# Altium project XXXX.467119.XXX.PrjPcb
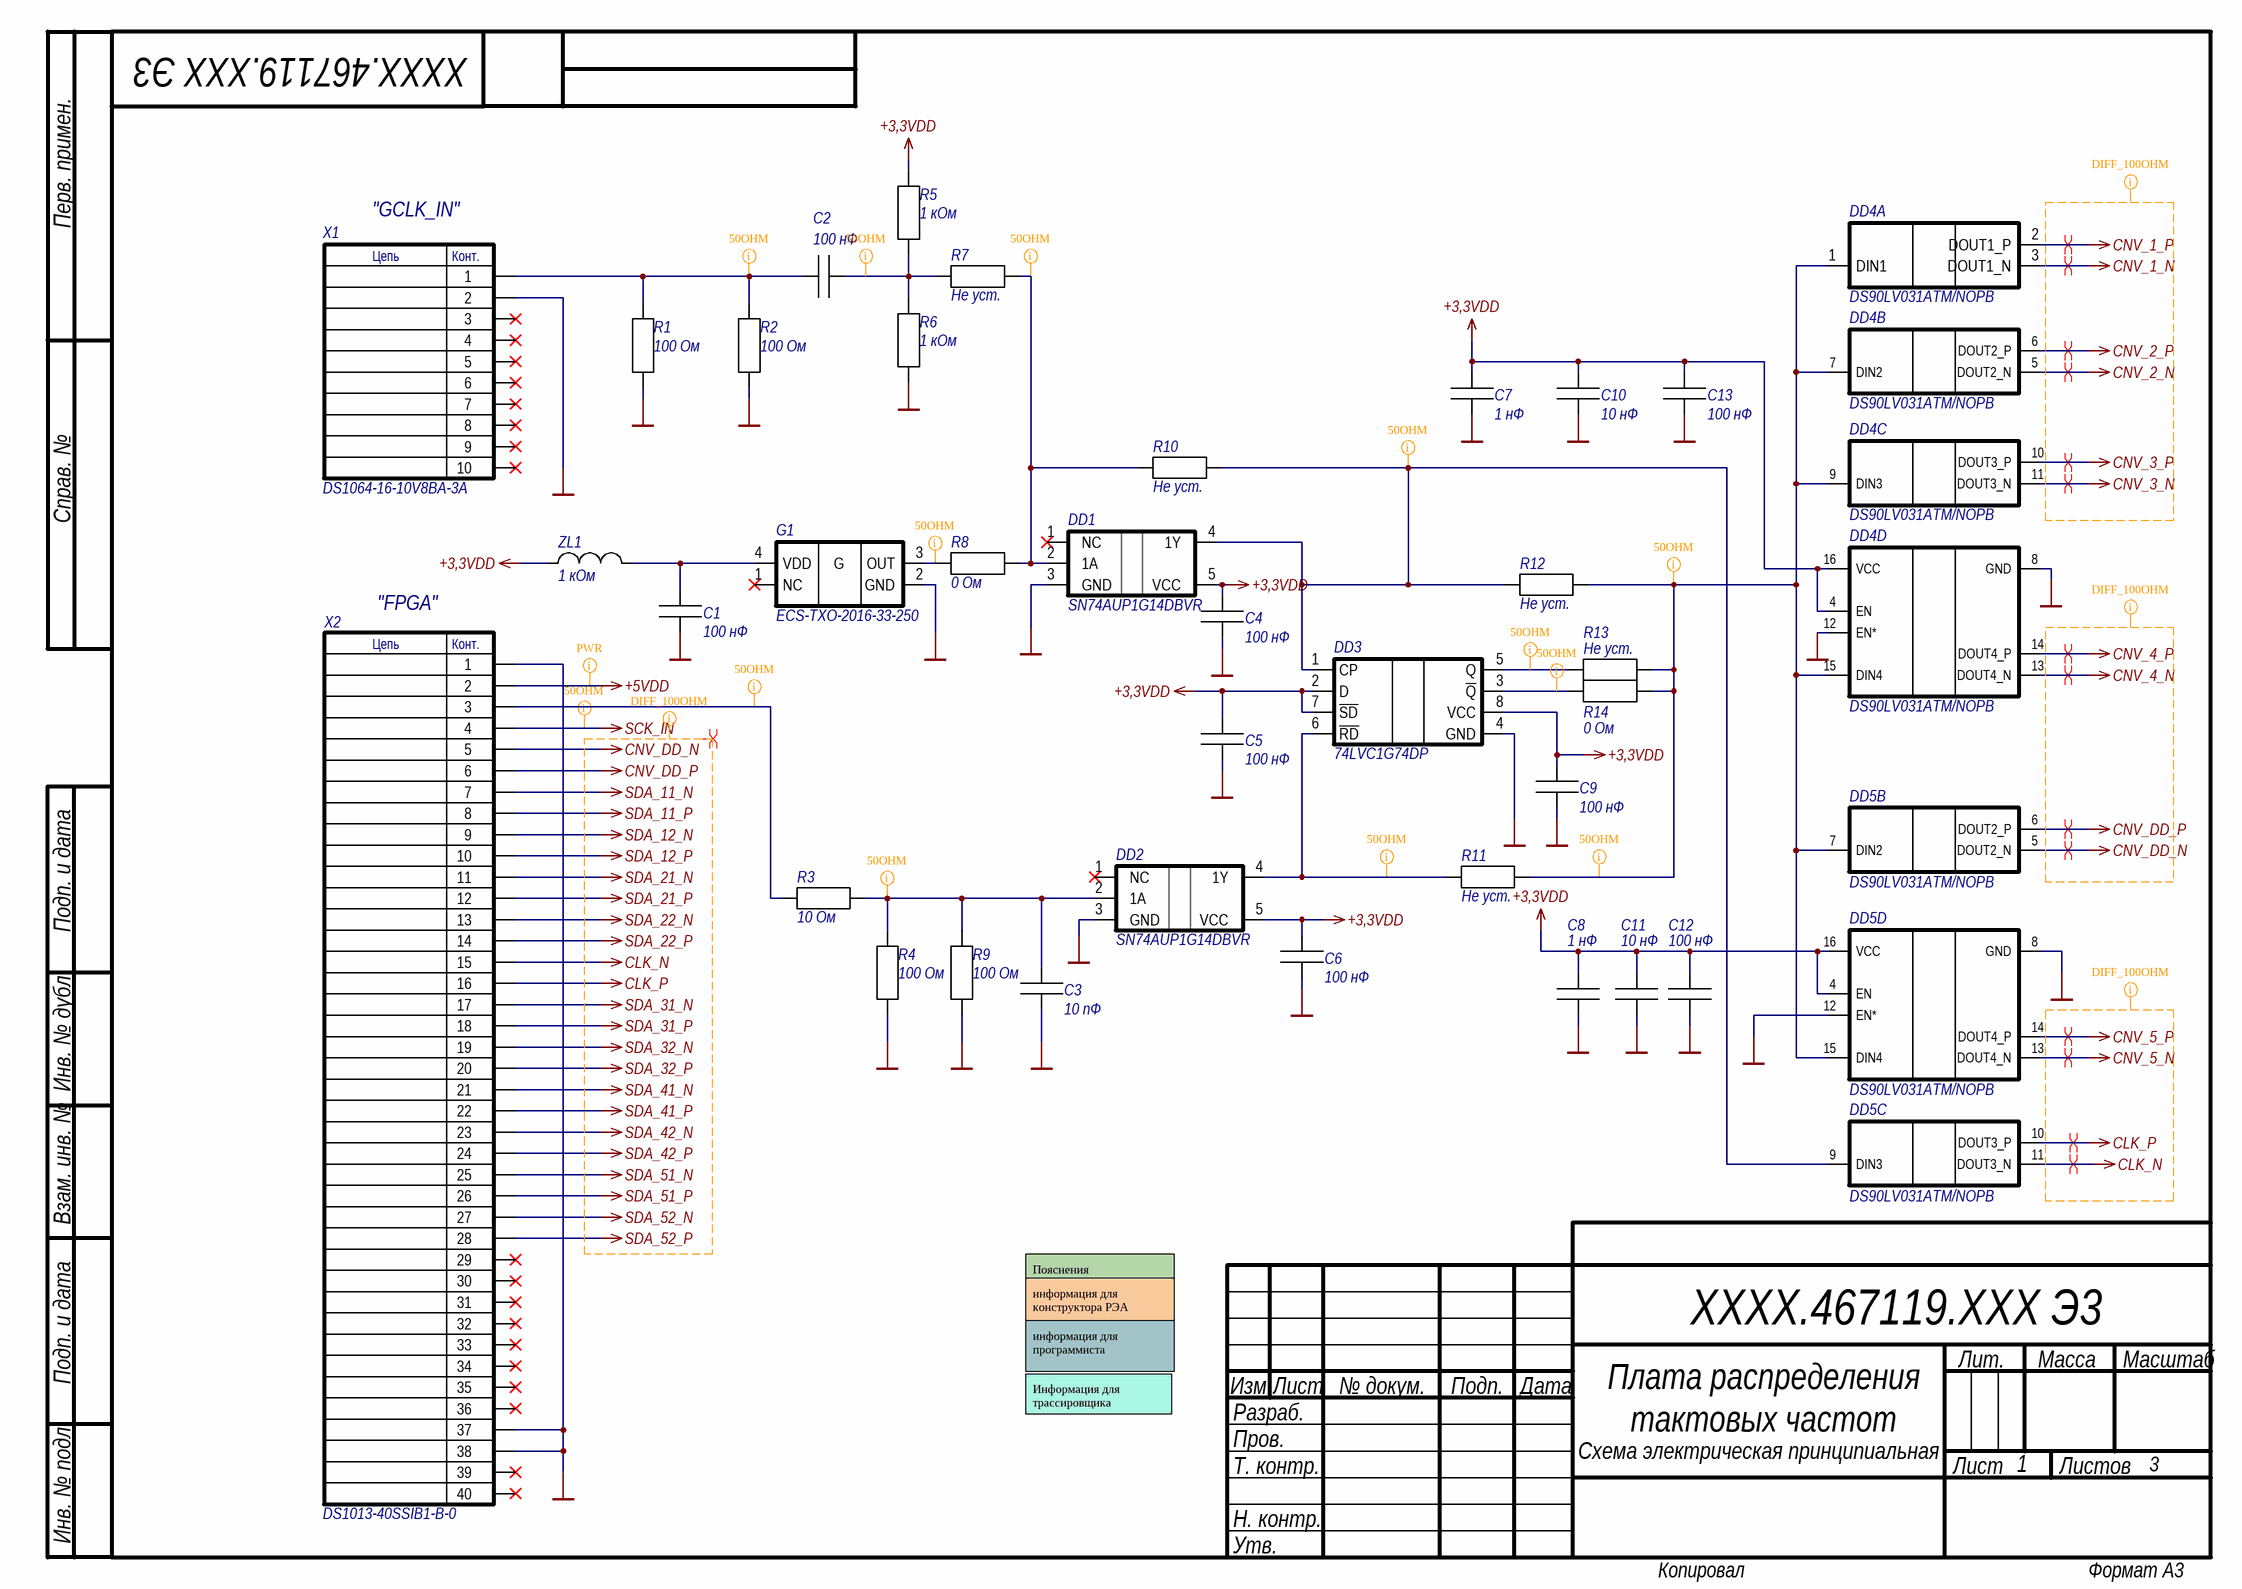
[diagram p0: xxxxxx.001_sh1_RTC.SchDoc]
3 sheets, 65 parts. Net scope: global (net labels, ports and power ports of the same name join across sheets).
Board file: XXXX.687252.XXX.PcbDoc
Sheets:
  xxxxxx.001_sh1_RTC.SchDoc
  xxxxxx.001_sh2_RTC.SchDoc
  xxxxxx.001_sh3_RTC.SchDoc

## Sheet xxxxxx.001_sh1_RTC.SchDoc
size 419 x 297 mm; DocumentNumber: XXXX.467119.XXX Э3; SheetNumber: 1; SheetTotal: 3; Title1str: Плата распределения; Title2str: тактовых частот; PageSetup: Record=PageOptions|CenterHorizontal=False|CenterVertical=False|PrintScale=1.00|XCorrection=0.00|YCorrection=0.00|PrintKind=1|BorderSize=5000000|LeftOffset=0|BottomOffset=0|Orientation=2|PaperLength=1000|PaperWidth=1000|Scale=100|PaperSource=7|PrintQuality=-4|MediaType=1|DitherType=10|PrintScaleMode=0|PaperKind=A3|PaperIndex=8; TypeOfSchem: Схема электрическая принципиальная; DocumentNumberE3: XXXX.467119.XXX Э3; DocumentName: Sheet1.SCHDOC

### Parts
C1  100 нФ  [CAPC160X080X080N]
C2  100 нФ  [CAPC160X080X080N]
C3  10 пФ  [CAPC160X080X080N]
C4  100 нФ  [CAPC160X080X080N]
C5  100 нФ  [CAPC160X080X080N]
C6  100 нФ  [CAPC160X080X080N]
C7  1 нФ  [CAPC160X080X080N]
C8  1 нФ  [CAPC160X080X080N]
C9  100 нФ  [CAPC160X080X080N]
C10  10 нФ  [CAPC160X080X080N]
C11  10 нФ  [CAPC160X080X080N]
C12  100 нФ  [CAPC160X080X080N]
C13  100 нФ  [CAPC160X080X080N]
DD1  SN74AUP1G14DBVR  [TI_DBV0005A_SOT23_5]
DD2  SN74AUP1G14DBVR  [TI_DBV0005A_SOT23_5]
DD3  74LVC1G74DP  [TSOP65P400X110-8N]
DD4  DS90LV031ATM/NOPB  [SOIC127P600X175-16N]  (parts A,B,C,D of 4)
DD5  DS90LV031ATM/NOPB  [SOIC127P600X175-16N]  (parts B,C,D of 4)
G1  ECS-TXO-2016-33-250  [OSCCC160X200X80-4N]
R1  100 Ом  [RESC160X080X045N]
R2  100 Ом  [RESC160X080X045N]
R3  10 Ом  [RESC160X080X045N]
R4  100 Ом  [RESC160X080X045N]
R5  1 кОм  [RESC160X080X045N]
R6  1 кОм  [RESC160X080X045N]
R7  Не уст.  [RESC160X080X045N]
R8  0 Ом  [RESC160X080X045N]
R9  100 Ом  [RESC160X080X045N]
R10  Не уст.  [RESC160X080X045N]
R11  Не уст.  [RESC160X080X045N]
R12  Не уст.  [RESC160X080X045N]
R13  Не уст.  [RESC160X080X045N]
R14  0 Ом  [RESC160X080X045N]
X1  DS1064-16-10V8BA-3A  [BHTH127x254_2X5]
X2  DS1013-40SSIB1-B-0  [BHTH254_2X20]
ZL1  1 кОм  [INDC100X050X050N]

### Nets
+3,3VDD: C4.1 C5.1 C6.1 C7.1 C8.1 C9.1 C10.1 C11.1 C12.1 C13.1 DD1.5(VCC) DD2.5(VCC) DD3.2(D) DD3.7(~{SD}) DD3.8(VCC) DD4.4(EN) DD4.16(VCC) DD5.4(EN) DD5.16(VCC) R5.1 ZL1.1
+5VDD: X2.2
CLK_N: DD5.11(DOUT3_N) X2.15
CLK_P: DD5.10(DOUT3_P) X2.16
CNV_1_N: DD4.3(DOUT1_N)
CNV_1_P: DD4.2(DOUT1_P)
CNV_2_N: DD4.5(DOUT2_N)
CNV_2_P: DD4.6(DOUT2_P)
CNV_3_N: DD4.11(DOUT3_N)
CNV_3_P: DD4.10(DOUT3_P)
CNV_4_N: DD4.13(DOUT4_N)
CNV_4_P: DD4.14(DOUT4_P)
CNV_5_N: DD5.13(DOUT4_N)
CNV_5_P: DD5.14(DOUT4_P)
CNV_DD_N: DD5.5(DOUT2_N) X2.5
CNV_DD_P: DD5.6(DOUT2_P) X2.6
GND: C1.2 C3.2 C4.2 C5.2 C6.2 C7.2 C8.2 C9.2 C10.2 C11.2 C12.2 C13.2 DD1.3(GND) DD2.3(GND) DD3.4(GND) DD4.8(GND) DD4.12(EN*) DD5.8(GND) DD5.12(EN*) G1.2(GND) R1.2 R2.2 R4.2 R6.2 R9.2 X1.2 X2.1 X2.37 X2.38
SCK_IN: X2.4
SDA_11_N: X2.7
SDA_11_P: X2.8
SDA_12_N: X2.9
SDA_12_P: X2.10
SDA_21_N: X2.11
SDA_21_P: X2.12
SDA_22_N: X2.13
SDA_22_P: X2.14
SDA_31_N: X2.17
SDA_31_P: X2.18
SDA_32_N: X2.19
SDA_32_P: X2.20
SDA_41_N: X2.21
SDA_41_P: X2.22
SDA_42_N: X2.23
SDA_42_P: X2.24
SDA_51_N: X2.25
SDA_51_P: X2.26
SDA_52_N: X2.27
SDA_52_P: X2.28
NetC1_1: C1.1 G1.4(VDD) ZL1.2
NetC2_1: C2.1 R1.1 R2.1 X1.1
NetC2_2: C2.2 R5.2 R6.1 R7.1
NetC3_1: C3.1 DD2.2(1A) R3.2 R4.1 R9.1
NetDD1_2: DD1.2(1A) R7.2 R8.2 R10.1
NetDD1_4: DD1.4(1Y) DD3.1(CP) DD5.9(DIN3) R10.2 R12.1
NetDD2_4: DD2.4(1Y) DD3.6(~{RD}) R11.1
NetDD3_3: DD3.3(~{Q}) R14.1
NetDD3_5: DD3.5(Q) R13.1
NetDD4_1: DD4.1(DIN1) DD4.7(DIN2) DD4.9(DIN3) DD4.15(DIN4) DD5.7(DIN2) DD5.15(DIN4) R11.2 R12.2 R13.2 R14.2
NetG1_3: G1.3(OUT) R8.1
NetR3_1: R3.1 X2.3

Not connected (* = marked no-connect by the designer): DD1 1(NC)*; DD2 1(NC)*; G1 1(NC)*; X1 3* 4* 5* 6* 7* 8* 9* 10*; X2 29* 30* 31* 32* 33* 34* 35* 36* 39* 40*

### Layout directives
differential pair: CLK_N, CLK_P, CNV_1_N, CNV_1_P, CNV_2_N, CNV_2_P, CNV_3_N, CNV_3_P, CNV_4_N, CNV_4_P, CNV_5_N, CNV_5_P, CNV_DD_N, CNV_DD_P, SDA_11_N, SDA_11_P, SDA_12_N, SDA_12_P, SDA_21_N, SDA_21_P, SDA_22_N, SDA_22_P, SDA_31_N, SDA_31_P, SDA_32_N, SDA_32_P, SDA_41_N, SDA_41_P, SDA_42_N, SDA_42_P, SDA_51_N, SDA_51_P, SDA_52_N, SDA_52_P
net class DIFF_100OHM: CLK_N, CLK_P, CNV_1_N, CNV_1_P, CNV_2_N, CNV_2_P, CNV_3_N, CNV_3_P, CNV_4_N, CNV_4_P, CNV_5_N, CNV_5_P, CNV_DD_N, CNV_DD_P, SDA_11_N, SDA_11_P, SDA_12_N, SDA_12_P, SDA_21_N, SDA_21_P, SDA_22_N, SDA_22_P, SDA_31_N, SDA_31_P, SDA_32_N, SDA_32_P, SDA_41_N, SDA_41_P, SDA_42_N, SDA_42_P, SDA_51_N, SDA_51_P, SDA_52_N, SDA_52_P
net class 50OHM: NetC2_1, NetC2_2, NetC3_1, NetDD1_2, NetDD1_4, NetDD2_4, NetDD3_3, NetDD3_5, NetDD4_1, NetG1_3, NetR3_1, SCK_IN
net class PWR: +5VDD

### Notes on the sheet
- "GCLK_IN"
- "FPGA"
- Пояснения
- информация для конструктора РЭА
- информация для программиста
- Информация для трассировщика
- Перв. примен.
- Справ. №
- Подп. и дата
- Инв. № дубл.
- Взам. инв. №
- Лит.
- Масса
- Масштаб
- Изм.
- Разраб.
- Лист
- № докум.
- Подп.
- Дата
- Т. контр.
- Пров.
- Листов
- Инв. № подл.
- Утв.
- Н. контр.
- Копировал
- Формат A3
- (in symbol 16896) Цепь; Конт.
- (in symbol 16897) Цепь; Конт.
- (in symbol 16902) G

### Library data of the parts
C1 C2 C4-C6 C9 C12 C13 = 16734: Chip Monolithic Ceramic Capacitor; Manufacturer: Murata; Part Number: GRM188R71E104KA01D; Number: 16734; Type: Конденсатор; Ceramic Type: X7R; Voltage: 25 В; Tolerance: ±10%; ValueBOM: Chip Monolithic Ceramic Capacitor, 0603, X7R, 25V, ±10%, 100n; Package: 0603; Series: GRM188; ValueSCH: 100 нФ; ComponentLink1Description: Datasheet; ComponentLink1URL: ftp://51.15.50.217/murata/capacitors/chip_monolithic_ceramic_cap.pdf; Note: *; ManufacturerPartNumber: GRM188R71E104KA01D
C3 = 274: Multilayer Ceramic Chip Capacitor; Manufacturer: Yageo; Part Number: CC0603GPNP09BN100; Number: 274; Type: Конденсатор; Ceramic Type: NP0; Voltage: 50 В; Tolerance: ±2%; ValueBOM: Multilayer Ceramic Chip Capacitor, 0603, NP0, 50V, ±2%, 10p; Package: 0603; Series: CC0603; ValueSCH: 10 пФ; HelpURL: http://www.yageo.com/e; ComponentLink1Description: Datasheet; ComponentLink1URL: ftp://51.15.50.217/yageo/capasitors/CC_series_(NP0).pdf#; Modify Date: 25.03.2009; Note: *; ManufacturerPartNumber: CC0603GPNP09BN100
C7 C8 = 16711: Chip Monolithic Ceramic Capacitor; Manufacturer: Murata; Part Number: GRM188R71H102KA01D; Number: 16711; Type: Конденсатор; Ceramic Type: X7R; Voltage: 50 В; Tolerance: ±10%; ValueBOM: Chip Monolithic Ceramic Capacitor, 0603, X7R, 50V, ±10%, 1n; Package: 0603; Series: GRM188; ValueSCH: 1 нФ; ComponentLink1Description: Datasheet; ComponentLink1URL: ftp://51.15.50.217/murata/capacitors/chip_monolithic_ceramic_cap.pdf; Note: *; ManufacturerPartNumber: GRM188R71H102KA01D
C10 C11 = 16728: Chip Monolithic Ceramic Capacitor; Manufacturer: Murata; Part Number: GRM188R71E103KA01D; Number: 16728; Type: Конденсатор; Ceramic Type: X7R; Voltage: 25 В; Tolerance: ±10%; ValueBOM: Chip Monolithic Ceramic Capacitor, 0603, X7R, 25V, ±10%, 10n; Package: 0603; Series: GRM188; ValueSCH: 10 нФ; ComponentLink1Description: Datasheet; ComponentLink1URL: ftp://51.15.50.217/murata/capacitors/chip_monolithic_ceramic_cap.pdf; Note: *; ManufacturerPartNumber: GRM188R71E103KA01D
DD1 DD2 = 16900: Low-Power Single Schmitt-Trigger Inverter; Manufacturer: Texas Instruments; Number: 16900; Type: Микросхема цифровая; Part Number: SN74AUP1G14DBVR; ValueSCH: SN74AUP1G14DBVR; ValueBOM: Low-Power Single Schmitt-Trigger Inverter; Modify Date: 21.06.2023; Mount: 1; Package: 101; Note: *; ManufacturerPartNumber: SN74AUP1G14DBVR
DD3 = 16899: Single D-type flip-flop with set and reset; Manufacturer: Nexperia; Number: 16899; Type: Микросхема цифровая; Part Number: 74LVC1G74DP; ValueSCH: 74LVC1G74DP; ValueBOM: Single D-type flip-flop with set and reset; Modify Date: 21.06.2023; Mount: 1; Package: 135; Note: *; ManufacturerPartNumber: 74LVC1G74DP
DD4 DD5 = 16898: 3-V LVDS Quad CMOS Differential Line Driver; Manufacturer: Texas Instruments; Number: 16898; Type: Микросхема цифровая; Part Number: DS90LV031ATM/NOPB; ValueSCH: DS90LV031ATM/NOPB; ValueBOM: 3-V LVDS Quad CMOS Differential Line Driver; Modify Date: 21.06.2023; Note: *; ManufacturerPartNumber: DS90LV031ATM/NOPB
G1 = 16902: SMD CMOS TCXO, 25 МГц, ±2.5ppm; Manufacturer: ECS INC INTERNATIONAL; Number: 16902; ValueSCH: 25 МГц; Type: Генератор; Package: 68; Series: TXO-2016; Part Number: ECS-TXO-2016-33-250; ValueBOM: SMD CMOS TCXO, 25 МГц, ±2.5ppm; Modify Date: 21.06.2023; Mount: 1; Note1SCH: 25 МГц; Note2SCH: ±2.5ppm; Note: *; ManufacturerPartNumber: ECS-TXO-2016-33-250
R1 R2 R4 R9 = 2702: General Purpose Chip Resistor; Manufacturer: Yageo; Part Number: RC0603FR-13100R; Number: 2702; Power: 100 мВт; Tolerance: ±1%; ValueBOM: General Purpose Chip Resistor, 0603, ±1%, 100R; Type: Резистор; Package: 0603; Series: RC0603; ValueSCH: 100 Ом; HelpURL: http://www.yageo.com/e; ComponentLink1Description: Datasheet; ComponentLink1URL: ftp://51.15.50.217/yageo/resistors/RC0603_series.pdf#; Modify Date: 04.01.2009; Note: *; ManufacturerPartNumber: RC0603FR-13100R
R3 = 2588: General Purpose Chip Resistor; Manufacturer: Yageo; Part Number: RC0603FR-1310R; Number: 2588; Power: 100 мВт; Tolerance: ±1%; ValueBOM: General Purpose Chip Resistor, 0603, ±1%, 10R; Type: Резистор; Package: 0603; Series: RC0603; ValueSCH: 10 Ом; HelpURL: http://www.yageo.com/e; ComponentLink1Description: Datasheet; ComponentLink1URL: ftp://51.15.50.217/yageo/resistors/RC0603_series.pdf#; Modify Date: 04.01.2009; Note: *; ManufacturerPartNumber: RC0603FR-1310R
R5 R6 = 2816: General Purpose Chip Resistor; Manufacturer: Yageo; Part Number: RC0603FR-131K; Number: 2816; Power: 100 мВт; Tolerance: ±1%; ValueBOM: General Purpose Chip Resistor, 0603, ±1%, 1K; Type: Резистор; Package: 0603; Series: RC0603; ValueSCH: 1 кОм; HelpURL: http://www.yageo.com/e; ComponentLink1Description: Datasheet; ComponentLink1URL: ftp://51.15.50.217/yageo/resistors/RC0603_series.pdf#; Modify Date: 04.01.2009; Note: *; ManufacturerPartNumber: RC0603FR-131K
R7 R10-R13 = 2058: General Purpose Chip Resistor; Manufacturer: Yageo; Part Number: RC0603JR-130R; Number: 2058; Power: 100 мВт; Tolerance: ±5%; ValueSCH: 0 Ом; ValueBOM: General Purpose Chip Resistor, 0603, ±5%, 0R; Type: Резистор; Package: 0603; Series: RC0603; HelpURL: http://www.yageo.com/e; ComponentLink1Description: Datasheet; ComponentLink1URL: ftp://51.15.50.217/yageo/resistors/RC0603_series.pdf#; Modify Date: 04.01.2009; Note: Не уст.; ManufacturerPartNumber: RC0603JR-130R
R8 R14 = 2058: General Purpose Chip Resistor; Manufacturer: Yageo; Part Number: RC0603JR-130R; Number: 2058; Power: 100 мВт; Tolerance: ±5%; ValueBOM: General Purpose Chip Resistor, 0603, ±5%, 0R; Type: Резистор; Package: 0603; Series: RC0603; ValueSCH: 0 Ом; HelpURL: http://www.yageo.com/e; ComponentLink1Description: Datasheet; ComponentLink1URL: ftp://51.15.50.217/yageo/resistors/RC0603_series.pdf#; Modify Date: 04.01.2009; Note: *; ManufacturerPartNumber: RC0603JR-130R
X1 = 16896: 1.27mm Box Header V/T Type H=7.1mm, 10 pin; Manufacturer: Connfly; Number: 16896; Type: Разъем; Series: DS1023-40; Part Number: DS1064-16-10V8BA-3A; ValueSCH: DS1064-16-10V8BA-3A; ValueBOM: 1.27mm Box Header V/T Type H=7.1mm, 10 pin; Modify Date: 21.06.2023; Note: *; ManufacturerPartNumber: DS1064-16-10V8BA-3A
X2 = 16897: 2.54mm Box Header, Two Rows, 40 pins; Manufacturer: Connfly; Number: 16897; ValueBOM: 2.54mm Box Header, Dual Rows, 40 pins; Type: Разъем; Series: DS1013; Part Number: DS1013-40SSIB1-B-0; ValueSCH: DS1013-40SSIB1-B-0; Modify Date: 21.06.2023; Note: *; ManufacturerPartNumber: DS1013-40SSIB1-B-0
ZL1 = 16895: Chip Ferrite Bead; Manufacturer: Murata; Part Number: BLM15AG102SN1D; Number: 16895; Current: 300 мА; Tolerance: ±25%; ValueBOM: Chip Ferrite Bead, 0402, 300мА, ±25%, 0.65 Ом @ 100 MHz; Type: Индуктивность; Package: 0402; Series: BLM15AG; ValueSCH: 1 кОм; HelpURL: http://www.murata.com/; Modify Date: 20.06.2023; Note: *; ManufacturerPartNumber: BLM15AG102SN1D

## Sheet xxxxxx.001_sh2_RTC.SchDoc
size 419 x 297 mm; DocumentNumber: 2; SheetNumber: 2; DocumentNumberE3: XXXX.467119.XXX Э3
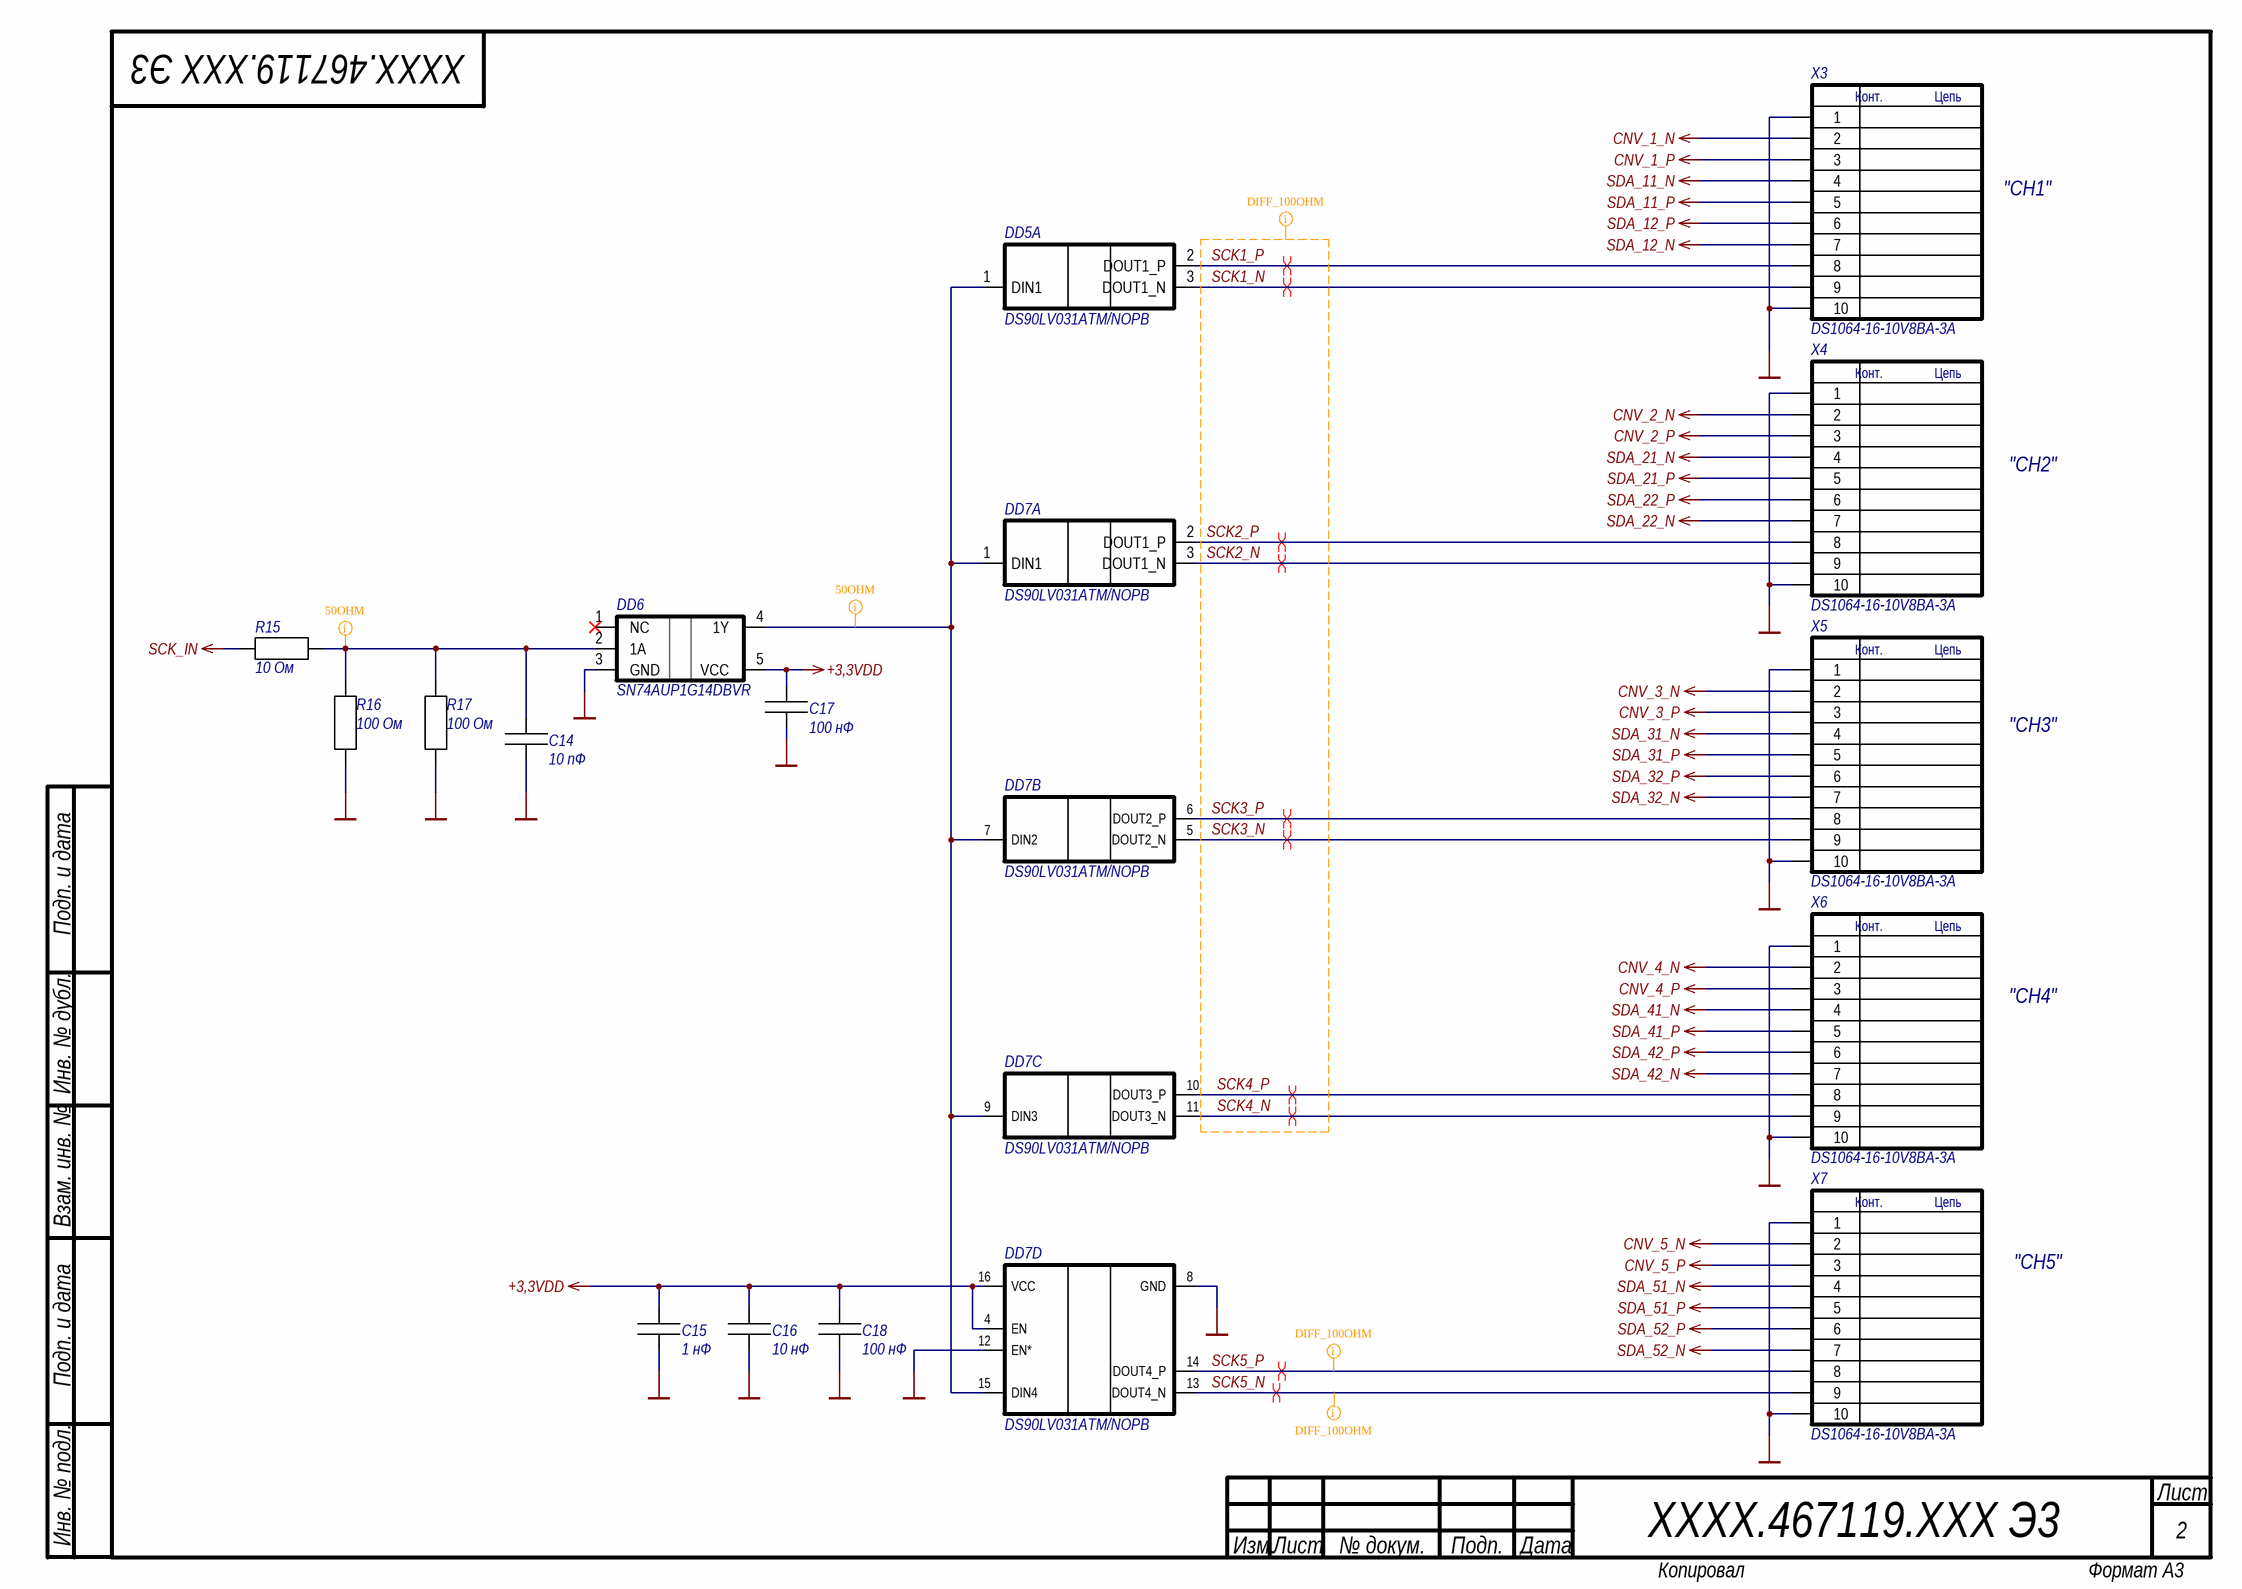
[diagram p1: xxxxxx.001_sh2_RTC.SchDoc]

### Parts
C14  10 пФ  [CAPC160X080X080N]
C15  1 нФ  [CAPC160X080X080N]
C16  10 нФ  [CAPC160X080X080N]
C17  100 нФ  [CAPC160X080X080N]
C18  100 нФ  [CAPC160X080X080N]
DD5  DS90LV031ATM/NOPB  [SOIC127P600X175-16N]  (part A of 4)
DD6  SN74AUP1G14DBVR  [TI_DBV0005A_SOT23_5]
DD7  DS90LV031ATM/NOPB  [SOIC127P600X175-16N]  (parts A,B,C,D of 4)
R15  10 Ом  [RESC160X080X045N]
R16  100 Ом  [RESC160X080X045N]
R17  100 Ом  [RESC160X080X045N]
X3  DS1064-16-10V8BA-3A  [BHTH127x254_2X5]
X4  DS1064-16-10V8BA-3A  [BHTH127x254_2X5]
X5  DS1064-16-10V8BA-3A  [BHTH127x254_2X5]
X6  DS1064-16-10V8BA-3A  [BHTH127x254_2X5]
X7  DS1064-16-10V8BA-3A  [BHTH127x254_2X5]

### Nets
+3,3VDD: C15.1 C16.1 C17.1 C18.1 DD6.5(VCC) DD7.4(EN) DD7.16(VCC)
CNV_1_N: X3.2
CNV_1_P: X3.3
CNV_2_N: X4.2
CNV_2_P: X4.3
CNV_3_N: X5.2
CNV_3_P: X5.3
CNV_4_N: X6.2
CNV_4_P: X6.3
CNV_5_N: X7.2
CNV_5_P: X7.3
GND: C14.2 C15.2 C16.2 C17.2 C18.2 DD6.3(GND) DD7.8(GND) DD7.12(EN*) R16.2 R17.2 X3.1 X3.10 X4.1 X4.10 X5.1 X5.10 X6.1 X6.10 X7.1 X7.10
SCK_IN: R15.1
SDA_11_N: X3.4
SDA_11_P: X3.5
SDA_12_N: X3.7
SDA_12_P: X3.6
SDA_21_N: X4.4
SDA_21_P: X4.5
SDA_22_N: X4.7
SDA_22_P: X4.6
SDA_31_N: X5.4
SDA_31_P: X5.5
SDA_32_N: X5.7
SDA_32_P: X5.6
SDA_41_N: X6.4
SDA_41_P: X6.5
SDA_42_N: X6.7
SDA_42_P: X6.6
SDA_51_N: X7.4
SDA_51_P: X7.5
SDA_52_N: X7.7
SDA_52_P: X7.6
SCK1_N: DD5.3(DOUT1_N) X3.9
SCK1_P: DD5.2(DOUT1_P) X3.8
SCK2_N: DD7.3(DOUT1_N) X4.9
SCK2_P: DD7.2(DOUT1_P) X4.8
SCK3_N: DD7.5(DOUT2_N) X5.9
SCK3_P: DD7.6(DOUT2_P) X5.8
SCK4_N: DD7.11(DOUT3_N) X6.9
SCK4_P: DD7.10(DOUT3_P) X6.8
SCK5_N: DD7.13(DOUT4_N) X7.9
SCK5_P: DD7.14(DOUT4_P) X7.8
NetC14_1: C14.1 DD6.2(1A) R15.2 R16.1 R17.1
NetDD5_1: DD5.1(DIN1) DD6.4(1Y) DD7.1(DIN1) DD7.7(DIN2) DD7.9(DIN3) DD7.15(DIN4)

Not connected (* = marked no-connect by the designer): DD6 1(NC)*

### Layout directives
differential pair: SCK1_N, SCK1_P, SCK2_N, SCK2_P, SCK3_N, SCK3_P, SCK4_N, SCK4_P, SCK5_N, SCK5_P
net class 50OHM: NetC14_1, NetDD5_1
net class DIFF_100OHM: SCK1_N, SCK1_P, SCK2_N, SCK2_P, SCK3_N, SCK3_P, SCK4_N, SCK4_P, SCK5_N, SCK5_P

### Notes on the sheet
- "CH1"
- "CH2"
- "CH3"
- "CH4"
- "CH5"
- Подп. и дата
- Инв. № дубл.
- Взам. инв. №
- Лист
- Инв. № подл.
- Изм.
- № докум.
- Подп.
- Дата
- Копировал
- Формат A3
- (in symbol 16896) Конт.; Цепь

### Library data of the parts
C14 = 274: as C3 on sheet xxxxxx.001_sh1_RTC; Package: 0603; Series: CC0603; ValueSCH: 10 пФ; HelpURL: http://www.yageo.com/e; ComponentLink1Description: Datasheet; ComponentLink1URL: ftp://51.15.50.217/yageo/capasitors/CC_series_(NP0).pdf#; Modify Date: 25.03.2009; Note: *; ManufacturerPartNumber: CC0603GPNP09BN100
C15 = 16711: as C7 on sheet xxxxxx.001_sh1_RTC; Package: 0603; Series: GRM188; ValueSCH: 1 нФ; ComponentLink1Description: Datasheet; ComponentLink1URL: ftp://51.15.50.217/murata/capacitors/chip_monolithic_ceramic_cap.pdf; Note: *; ManufacturerPartNumber: GRM188R71H102KA01D
C16 = 16728: as C10 on sheet xxxxxx.001_sh1_RTC; Package: 0603; Series: GRM188; ValueSCH: 10 нФ; ComponentLink1Description: Datasheet; ComponentLink1URL: ftp://51.15.50.217/murata/capacitors/chip_monolithic_ceramic_cap.pdf; Note: *; ManufacturerPartNumber: GRM188R71E103KA01D
C17 C18 = 16734: as C1 on sheet xxxxxx.001_sh1_RTC; Package: 0603; Series: GRM188; ValueSCH: 100 нФ; ComponentLink1Description: Datasheet; ComponentLink1URL: ftp://51.15.50.217/murata/capacitors/chip_monolithic_ceramic_cap.pdf; Note: *; ManufacturerPartNumber: GRM188R71E104KA01D
DD5 DD7 = 16898: as DD4 on sheet xxxxxx.001_sh1_RTC; Type: Микросхема цифровая; Part Number: DS90LV031ATM/NOPB; ValueSCH: DS90LV031ATM/NOPB; ValueBOM: 3-V LVDS Quad CMOS Differential Line Driver; Modify Date: 21.06.2023; Note: *; ManufacturerPartNumber: DS90LV031ATM/NOPB
DD6 = 16900: as DD1 on sheet xxxxxx.001_sh1_RTC; Type: Микросхема цифровая; Part Number: SN74AUP1G14DBVR; ValueSCH: SN74AUP1G14DBVR; ValueBOM: Low-Power Single Schmitt-Trigger Inverter; Modify Date: 21.06.2023; Mount: 1; Package: 101; Note: *; ManufacturerPartNumber: SN74AUP1G14DBVR
R15 = 2588: as R3 on sheet xxxxxx.001_sh1_RTC; Type: Резистор; Package: 0603; Series: RC0603; ValueSCH: 10 Ом; HelpURL: http://www.yageo.com/e; ComponentLink1Description: Datasheet; ComponentLink1URL: ftp://51.15.50.217/yageo/resistors/RC0603_series.pdf#; Modify Date: 04.01.2009; Note: *; ManufacturerPartNumber: RC0603FR-1310R
R16 R17 = 2702: as R1 on sheet xxxxxx.001_sh1_RTC; Type: Резистор; Package: 0603; Series: RC0603; ValueSCH: 100 Ом; HelpURL: http://www.yageo.com/e; ComponentLink1Description: Datasheet; ComponentLink1URL: ftp://51.15.50.217/yageo/resistors/RC0603_series.pdf#; Modify Date: 04.01.2009; Note: *; ManufacturerPartNumber: RC0603FR-13100R
X3-X7 = 16896: as X1 on sheet xxxxxx.001_sh1_RTC; Type: Разъем; Series: DS1064-16; Part Number: DS1064-16-10V8BA-3A; ValueSCH: DS1064-16-10V8BA-3A; ValueBOM: 1.27mm Box Header V/T Type H=7.1mm, 10 pin; Modify Date: 21.06.2023; Note: *; ManufacturerPartNumber: DS1064-16-10V8BA-3A

## Sheet xxxxxx.001_sh3_RTC.SchDoc
size 419 x 297 mm; DocumentNumber: 3; SheetNumber: 3; DocumentNumberE3: XXXX.467119.XXX Э3
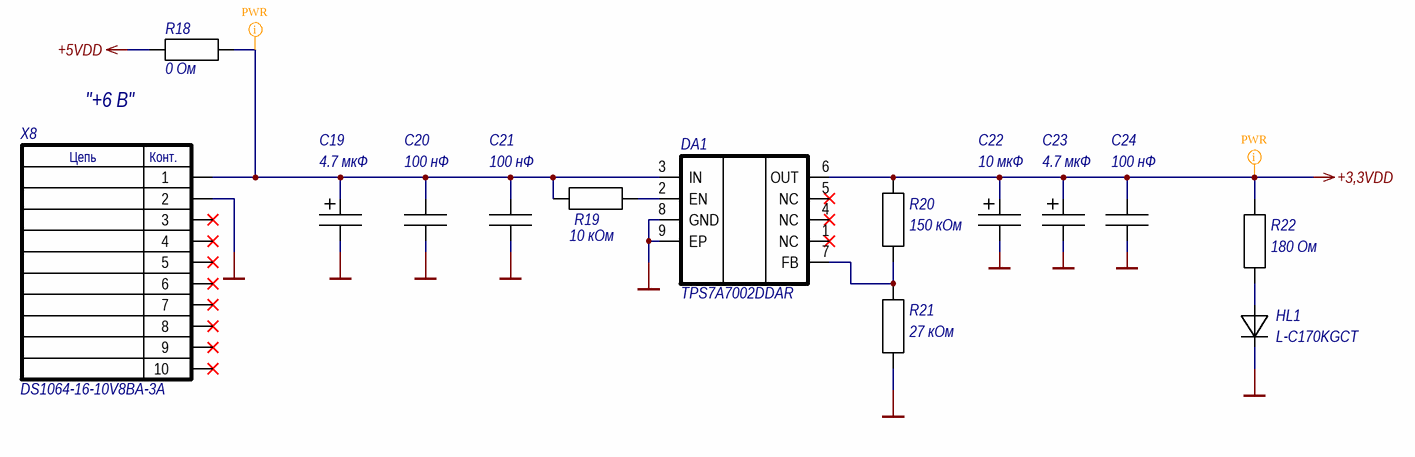
[diagram p2: xxxxxx.001_sh3_RTC.SchDoc]

### Parts
C19  4.7 мкФ  [CAPMP3216X180N]
C20  100 нФ  [CAPC160X080X080N]
C21  100 нФ  [CAPC160X080X080N]
C22  10 мкФ  [CAPMP3216X180N]
C23  4.7 мкФ  [CAPMP3216X180N]
C24  100 нФ  [CAPC160X080X080N]
DA1  TPS7A7002DDAR  [SOIC127P600X170_HS-9N]
HL1  L-C170KGCT  [LEDC200X125X075N_RED]
R18  0 Ом  [RESC160X080X045N]
R19  10 кОм  [RESC160X080X045N]
R20  150 кОм  [RESC160X080X045N]
R21  27 кОм  [RESC160X080X045N]
R22  180 Ом  [RESC160X080X045N]
X8  DS1064-16-10V8BA-3A  [BHTH127x254_2X5]

### Nets
+3,3VDD: C22.1 C23.1 C24.1 DA1.6(OUT) R20.1 R22.1
+5VDD: R18.1
GND: C19.2 C20.2 C21.2 C22.2 C23.2 C24.2 DA1.8(GND) DA1.9(EP) HL1.2 R21.2 X8.2
NetC19_1: C19.1 C20.1 C21.1 DA1.3(IN) R18.2 R19.1 X8.1
NetDA1_2: DA1.2(EN) R19.2
NetDA1_7: DA1.7(FB) R20.2 R21.1
NetHL1_1: HL1.1 R22.2

Not connected (* = marked no-connect by the designer): DA1 1(NC)* 4(NC)* 5(NC)*; X8 3* 4* 5* 6* 7* 8* 9* 10*

### Layout directives
net class PWR: +3,3VDD, NetC19_1

### Notes on the sheet
- (near R18) "+6 В"
- Подп. и дата
- Инв. № дубл.
- Взам. инв. №
- Лист
- Инв. № подл.
- Изм.
- № докум.
- Подп.
- Дата
- Копировал
- Формат A3
- (in symbol 16896) Цепь; Конт.

### Library data of the parts
C19 C23 = 16907: Solid Tantalum Surface Mount Capacitor; Manufacturer: AVX; Part Number: TAJA475M025RNJ; Number: 16907; Type: Конденсатор; Voltage: 25 В; Tolerance: ±20%; ValueBOM: Solid Tantalum Surface Mount Capacitor, CAP TNT A, 4.7u x 25V; Package: CAP TNT A; Series: TAJ; Ceramic Type: 4.7 мкФ; ValueSCH: 4.7 мкФ; HelpURL: http://www.avx.com/; ComponentLink1Description: Datasheet; ComponentLink1URL: ftp://51.15.50.217/avx/capacitors/TAJ.PDF; Modify Date: 20.02.2009; Note: *; ManufacturerPartNumber: TAJA475M025RNJ
C20 C21 C24 = 16734: as C1 on sheet xxxxxx.001_sh1_RTC; Package: 0603; Series: GRM188; ValueSCH: 100 нФ; ComponentLink1Description: Datasheet; ComponentLink1URL: ftp://51.15.50.217/murata/capacitors/chip_monolithic_ceramic_cap.pdf; Note: *; ManufacturerPartNumber: GRM188R71E104KA01D
C22 = 16905: Solid Tantalum Surface Mount Capacitor; Manufacturer: AVX; Part Number: TAJA106M016RNJ; Number: 16905; Type: Конденсатор; Voltage: 16 В; Tolerance: ±20%; ValueBOM: Solid Tantalum Surface Mount Capacitor, CAP TNT A, 10u x 16V; Package: CAP TNT A; Series: TAJ; Ceramic Type: 10 мкФ; ValueSCH: 10 мкФ; HelpURL: http://www.avx.com/; ComponentLink1Description: Datasheet; ComponentLink1URL: ftp://51.15.50.217/avx/capacitors/TAJ.PDF; Modify Date: 19.02.2009; Note: *; ManufacturerPartNumber: TAJA106M016RNJ
DA1 = 16901: Very Low Input, Very Low Dropout 3-A Regulator With Enable; Manufacturer: Texas Instruments; Number: 16901; Type: Микросхема аналоговая; Part Number: TPS7A7002DDAR; ValueSCH: TPS7A7002DDAR; ValueBOM: Very Low Input, Very Low Dropout 3-A Regulator With Enable; Modify Date: 21.06.2023; Note: *; ManufacturerPartNumber: TPS7A7002DDAR
HL1 = 16903: Светодиод поверхностного монтажа, зеленый, 0805; Manufacturer: Para Light; Number: 16903; Current: 30 мА; Intensity: 30 мКд; Color: Green; Type: Светодиод; Package: 0805; Part Number: L-C170KGCT; ValueSCH: L-C170KGCT; ValueBOM: Светодиод поверхностного монтажа, зеленый, 0805; Modify Date: 21.06.2023; Note: *; ManufacturerPartNumber: L-C170KGCT
R18 = 2058: as R8 on sheet xxxxxx.001_sh1_RTC; Type: Резистор; Package: 0603; Series: RC0603; ValueSCH: 0 Ом; HelpURL: http://www.yageo.com/e; ComponentLink1Description: Datasheet; ComponentLink1URL: ftp://51.15.50.217/yageo/resistors/RC0603_series.pdf#; Modify Date: 04.01.2009; Note: *; ManufacturerPartNumber: RC0603JR-130R
R19 = 2930: General Purpose Chip Resistor; Manufacturer: Yageo; Part Number: RC0603FR-1310K; Number: 2930; Power: 100 мВт; Tolerance: ±1%; ValueBOM: General Purpose Chip Resistor, 0603, ±1%, 10K; Type: Резистор; Package: 0603; Series: RC0603; ValueSCH: 10 кОм; HelpURL: http://www.yageo.com/e; ComponentLink1Description: Datasheet; ComponentLink1URL: ftp://51.15.50.217/yageo/resistors/RC0603_series.pdf#; Modify Date: 04.01.2009; Note: *; ManufacturerPartNumber: RC0603FR-1310K
R20 = 3062: General Purpose Chip Resistor; Manufacturer: Yageo; Part Number: RC0603FR-13150K; Number: 3062; Power: 100 мВт; Tolerance: ±1%; ValueBOM: General Purpose Chip Resistor, 0603, ±1%, 150K; Type: Резистор; Package: 0603; Series: RC0603; ValueSCH: 150 кОм; HelpURL: http://www.yageo.com/e; ComponentLink1Description: Datasheet; ComponentLink1URL: ftp://51.15.50.217/yageo/resistors/RC0603_series.pdf#; Modify Date: 04.01.2009; Note: *; ManufacturerPartNumber: RC0603FR-13150K
R21 = 2977: General Purpose Chip Resistor; Manufacturer: Yageo; Part Number: RC0603FR-1327K; Number: 2977; Power: 100 мВт; Tolerance: ±1%; ValueBOM: General Purpose Chip Resistor, 0603, ±1%, 27K; Type: Резистор; Package: 0603; Series: RC0603; ValueSCH: 27 кОм; HelpURL: http://www.yageo.com/e; ComponentLink1Description: Datasheet; ComponentLink1URL: ftp://51.15.50.217/yageo/resistors/RC0603_series.pdf#; Modify Date: 04.01.2009; Note: *; ManufacturerPartNumber: RC0603FR-1327K
R22 = 2729: General Purpose Chip Resistor; Manufacturer: Yageo; Part Number: RC0603FR-13180R; Number: 2729; Power: 100 мВт; Tolerance: ±1%; ValueBOM: General Purpose Chip Resistor, 0603, ±1%, 180R; Type: Резистор; Package: 0603; Series: RC0603; ValueSCH: 180 Ом; HelpURL: http://www.yageo.com/e; ComponentLink1Description: Datasheet; ComponentLink1URL: ftp://51.15.50.217/yageo/resistors/RC0603_series.pdf#; Modify Date: 04.01.2009; Note: *; ManufacturerPartNumber: RC0603FR-13180R
X8 = 16896: as X1 on sheet xxxxxx.001_sh1_RTC; Type: Разъем; Series: DS1023-40; Part Number: DS1064-16-10V8BA-3A; ValueSCH: DS1064-16-10V8BA-3A; ValueBOM: 1.27mm Box Header V/T Type H=7.1mm, 10 pin; Modify Date: 21.06.2023; Note: *; ManufacturerPartNumber: DS1064-16-10V8BA-3A

## Nets that join several sheets
+3,3VDD: xxxxxx.001_sh1_RTC (21 pins), xxxxxx.001_sh2_RTC (7 pins), xxxxxx.001_sh3_RTC (6 pins)
+5VDD: xxxxxx.001_sh1_RTC (X2.2), xxxxxx.001_sh3_RTC (R18.1)
CNV_1_N: xxxxxx.001_sh1_RTC (DD4.3), xxxxxx.001_sh2_RTC (X3.2)
CNV_1_P: xxxxxx.001_sh1_RTC (DD4.2), xxxxxx.001_sh2_RTC (X3.3)
CNV_2_N: xxxxxx.001_sh1_RTC (DD4.5), xxxxxx.001_sh2_RTC (X4.2)
CNV_2_P: xxxxxx.001_sh1_RTC (DD4.6), xxxxxx.001_sh2_RTC (X4.3)
CNV_3_N: xxxxxx.001_sh1_RTC (DD4.11), xxxxxx.001_sh2_RTC (X5.2)
CNV_3_P: xxxxxx.001_sh1_RTC (DD4.10), xxxxxx.001_sh2_RTC (X5.3)
CNV_4_N: xxxxxx.001_sh1_RTC (DD4.13), xxxxxx.001_sh2_RTC (X6.2)
CNV_4_P: xxxxxx.001_sh1_RTC (DD4.14), xxxxxx.001_sh2_RTC (X6.3)
CNV_5_N: xxxxxx.001_sh1_RTC (DD5.13), xxxxxx.001_sh2_RTC (X7.2)
CNV_5_P: xxxxxx.001_sh1_RTC (DD5.14), xxxxxx.001_sh2_RTC (X7.3)
GND: xxxxxx.001_sh1_RTC (29 pins), xxxxxx.001_sh2_RTC (20 pins), xxxxxx.001_sh3_RTC (11 pins)
SCK_IN: xxxxxx.001_sh1_RTC (X2.4), xxxxxx.001_sh2_RTC (R15.1)
SDA_11_N: xxxxxx.001_sh1_RTC (X2.7), xxxxxx.001_sh2_RTC (X3.4)
SDA_11_P: xxxxxx.001_sh1_RTC (X2.8), xxxxxx.001_sh2_RTC (X3.5)
SDA_12_N: xxxxxx.001_sh1_RTC (X2.9), xxxxxx.001_sh2_RTC (X3.7)
SDA_12_P: xxxxxx.001_sh1_RTC (X2.10), xxxxxx.001_sh2_RTC (X3.6)
SDA_21_N: xxxxxx.001_sh1_RTC (X2.11), xxxxxx.001_sh2_RTC (X4.4)
SDA_21_P: xxxxxx.001_sh1_RTC (X2.12), xxxxxx.001_sh2_RTC (X4.5)
SDA_22_N: xxxxxx.001_sh1_RTC (X2.13), xxxxxx.001_sh2_RTC (X4.7)
SDA_22_P: xxxxxx.001_sh1_RTC (X2.14), xxxxxx.001_sh2_RTC (X4.6)
SDA_31_N: xxxxxx.001_sh1_RTC (X2.17), xxxxxx.001_sh2_RTC (X5.4)
SDA_31_P: xxxxxx.001_sh1_RTC (X2.18), xxxxxx.001_sh2_RTC (X5.5)
SDA_32_N: xxxxxx.001_sh1_RTC (X2.19), xxxxxx.001_sh2_RTC (X5.7)
SDA_32_P: xxxxxx.001_sh1_RTC (X2.20), xxxxxx.001_sh2_RTC (X5.6)
SDA_41_N: xxxxxx.001_sh1_RTC (X2.21), xxxxxx.001_sh2_RTC (X6.4)
SDA_41_P: xxxxxx.001_sh1_RTC (X2.22), xxxxxx.001_sh2_RTC (X6.5)
SDA_42_N: xxxxxx.001_sh1_RTC (X2.23), xxxxxx.001_sh2_RTC (X6.7)
SDA_42_P: xxxxxx.001_sh1_RTC (X2.24), xxxxxx.001_sh2_RTC (X6.6)
SDA_51_N: xxxxxx.001_sh1_RTC (X2.25), xxxxxx.001_sh2_RTC (X7.4)
SDA_51_P: xxxxxx.001_sh1_RTC (X2.26), xxxxxx.001_sh2_RTC (X7.5)
SDA_52_N: xxxxxx.001_sh1_RTC (X2.27), xxxxxx.001_sh2_RTC (X7.7)
SDA_52_P: xxxxxx.001_sh1_RTC (X2.28), xxxxxx.001_sh2_RTC (X7.6)

## Assembly variants
Основная схема СБ: not fitted R7 R10 R11 R12 R13